# EasyEDA Pro project ADA4530_2025-03-15.epro, board PCB4
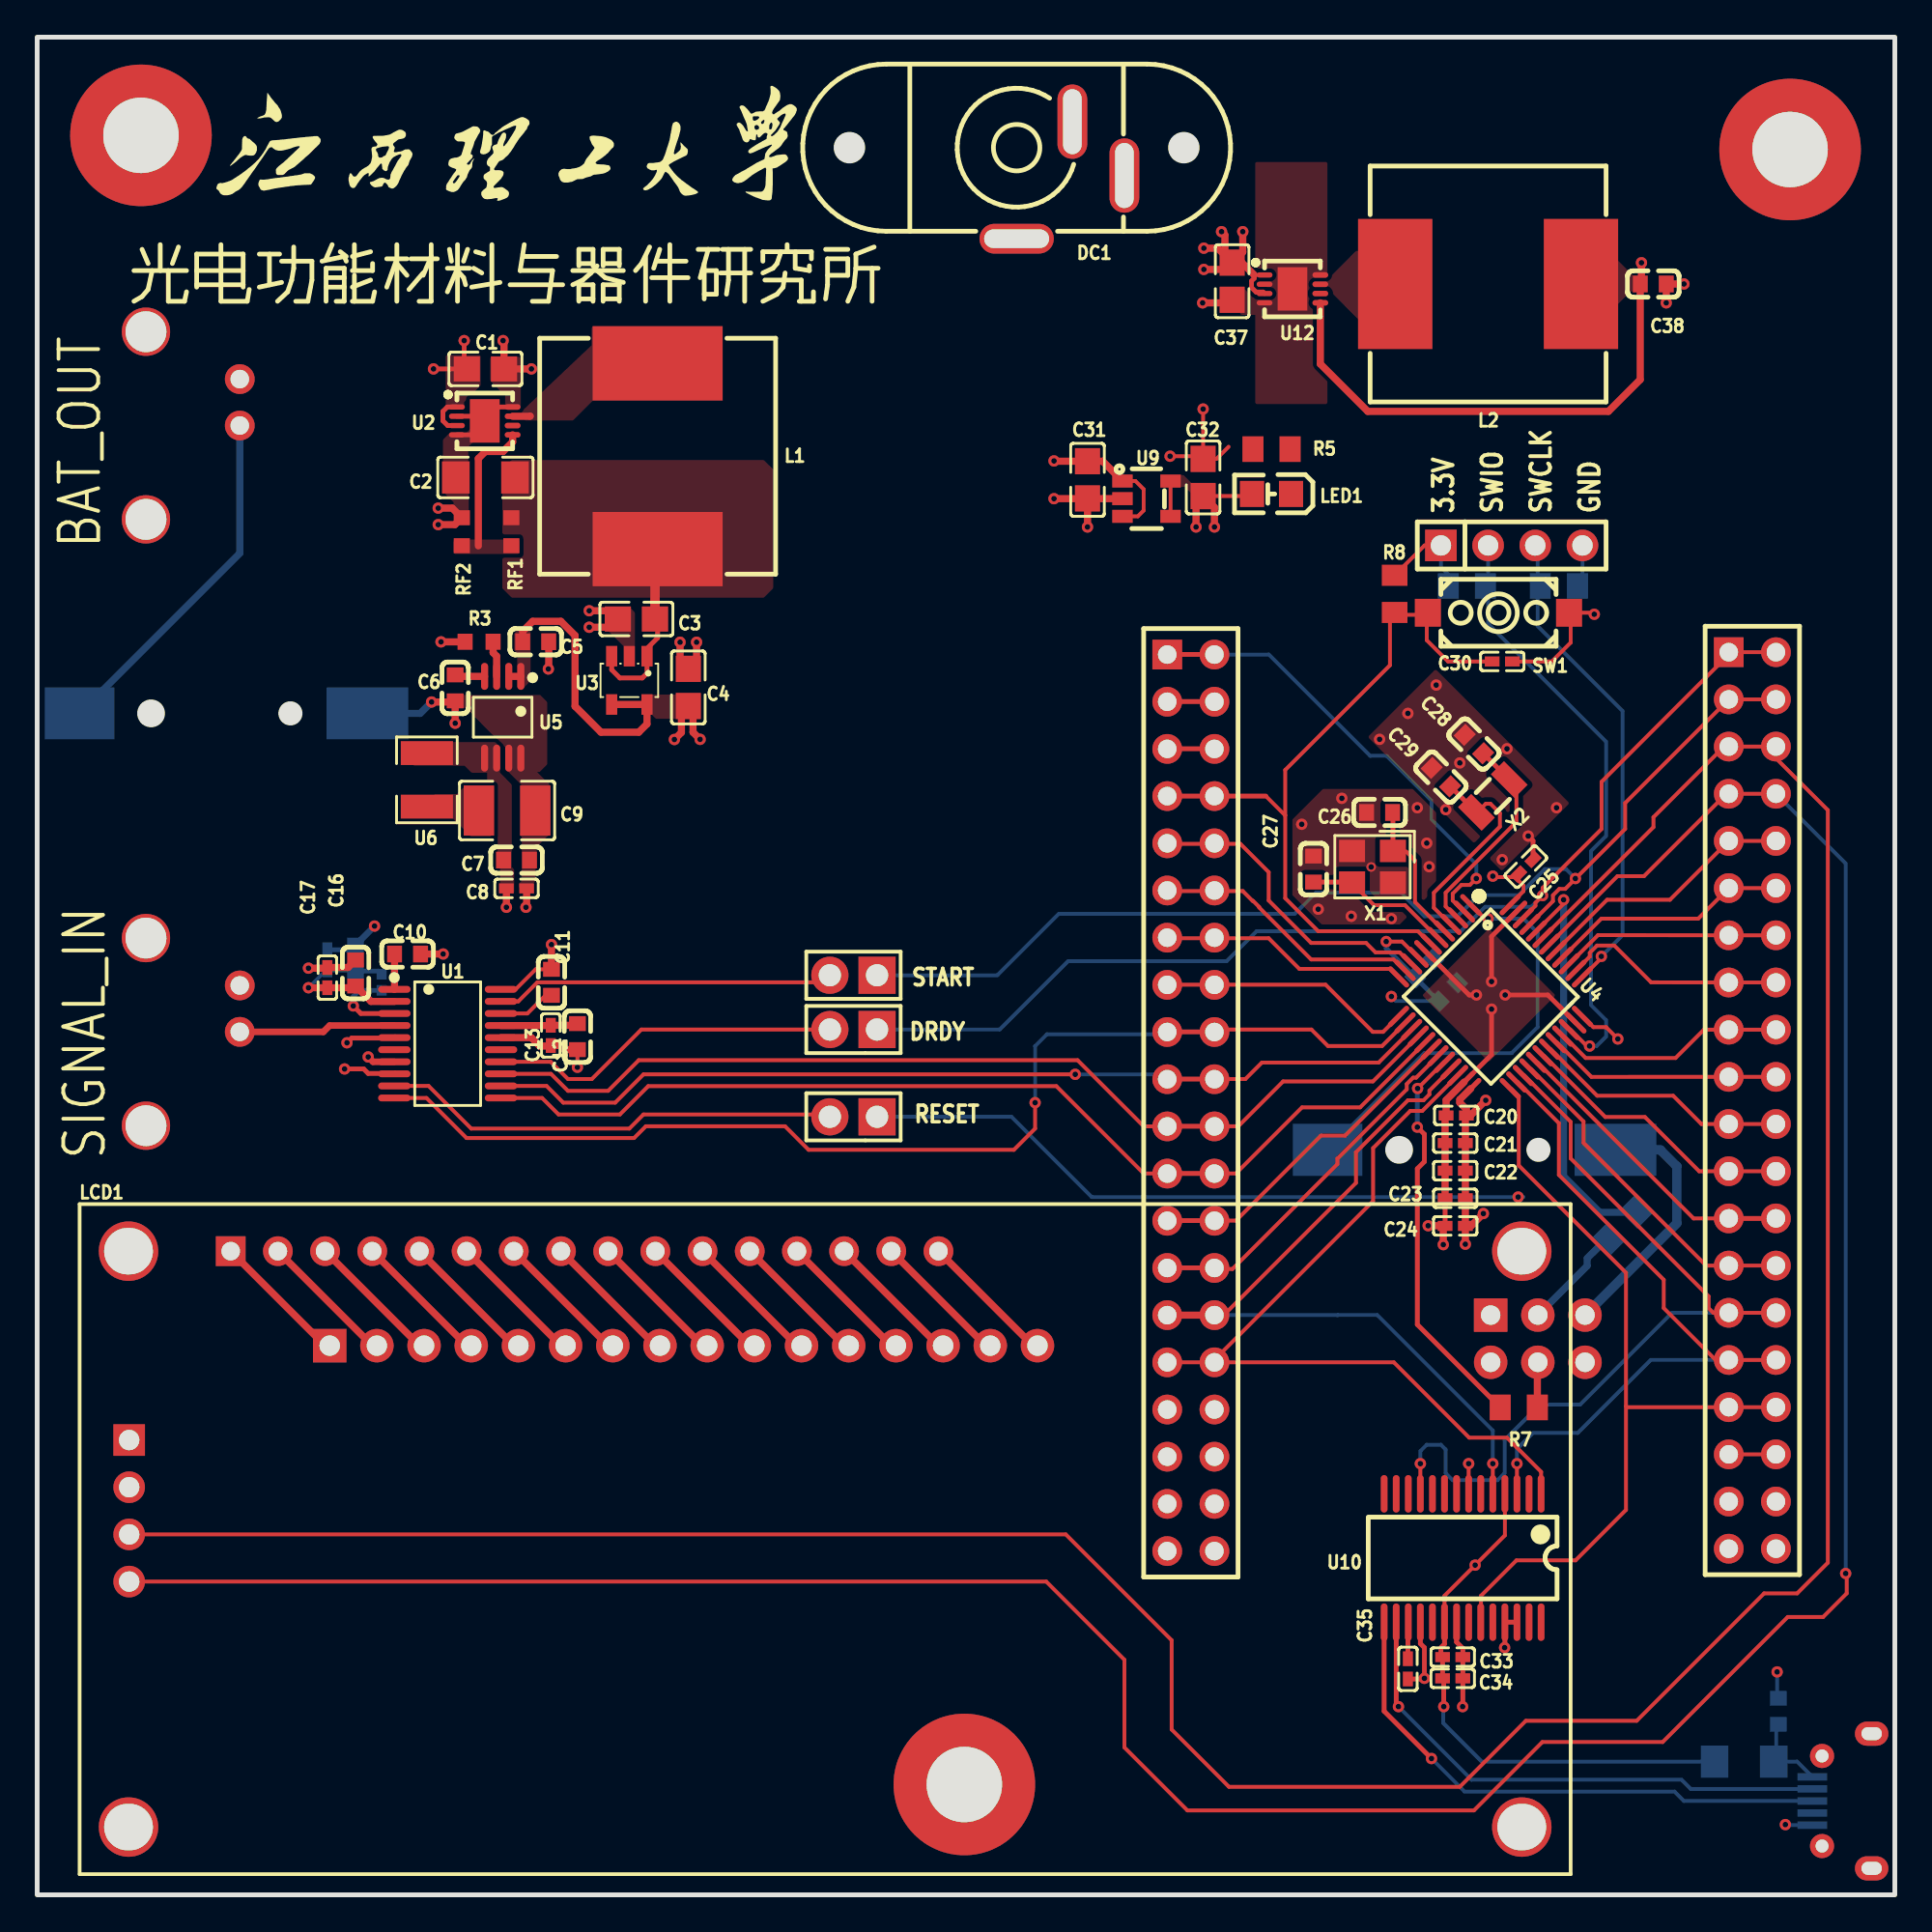
[diagram p10: board, top side]
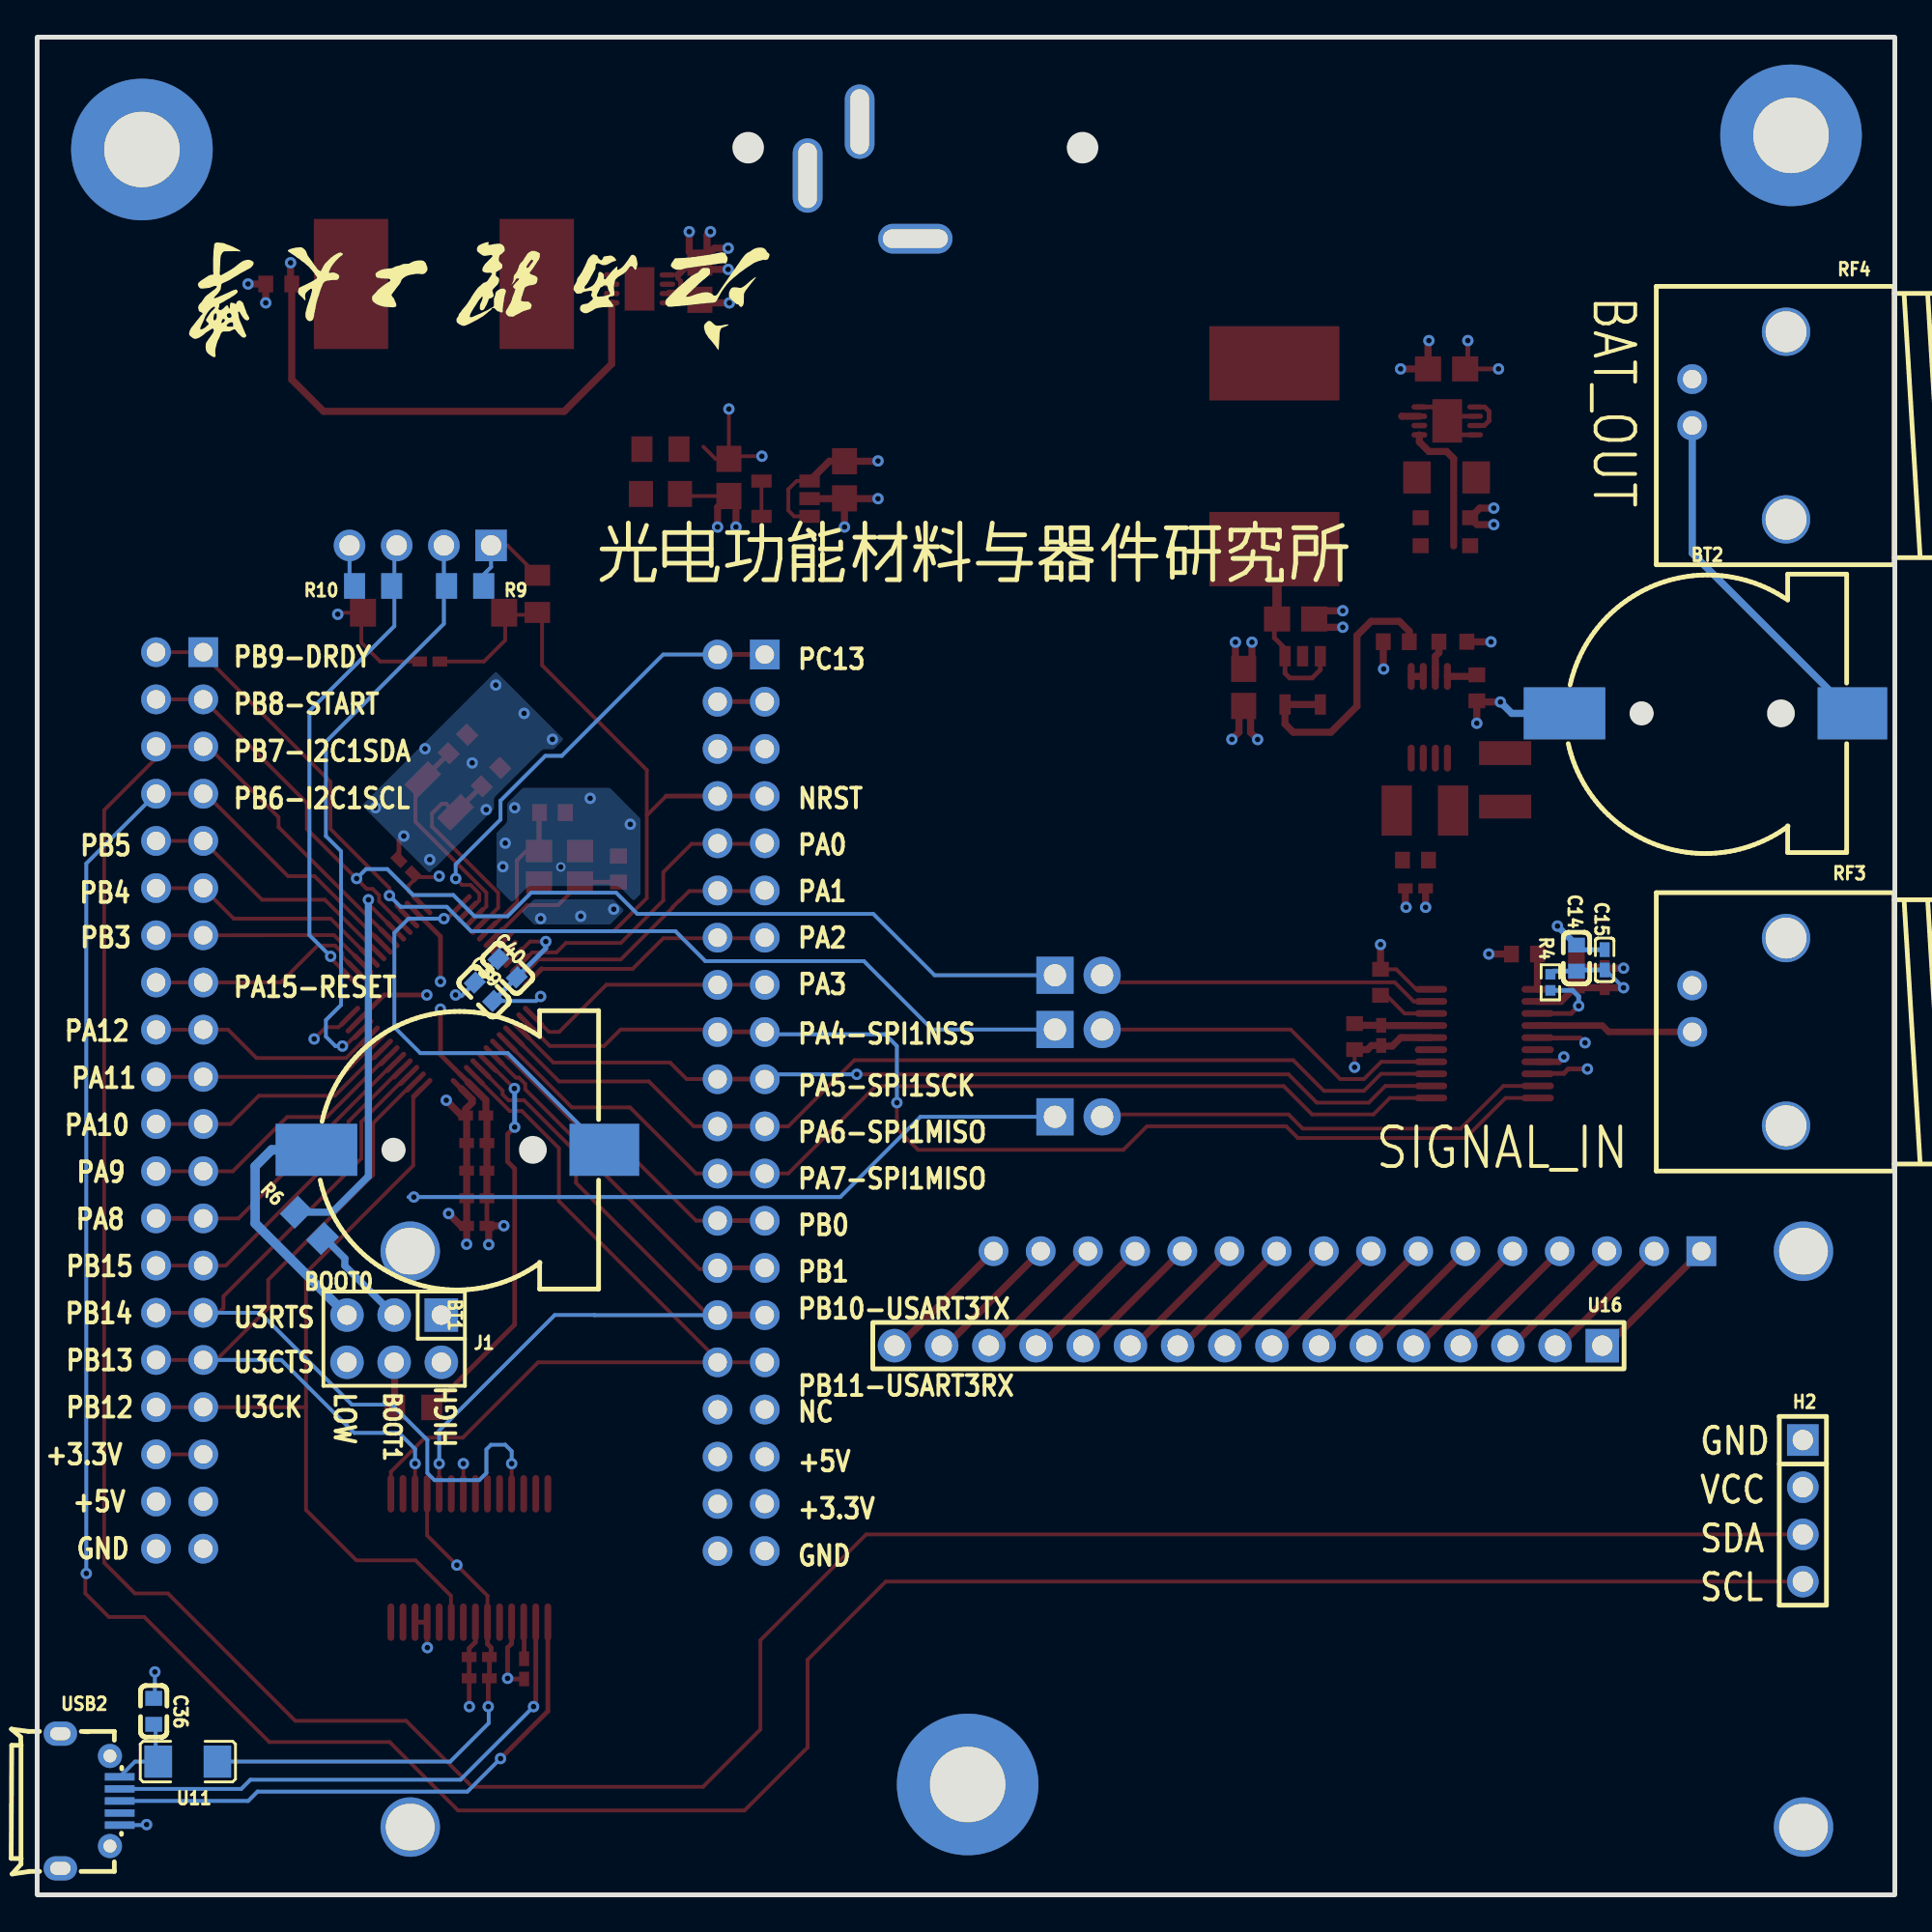
[diagram p11: board, bottom side, seen from below]

Outline 100 x 100 mm; copper layers: Top Layer, 内层1-GND, 内层2-power, Bottom Layer. Coordinates in mm from the lower left corner of the outline.
Outline path: rectangle 0,100 100,0
Stack: Top Layer 0.035mm 外层铜厚1oz / Dielectric1 0.2104mm 7628 RC49% 8.6mil / 内层1-GND 0.0152mm 内层铜厚 / Dielectric2 1.065mm 1.1mm H/HOZ Copper / 内层2-power 0.0152mm 内层铜厚 / Dielectric3 0.2104mm 7628 RC49% 8.6mil / Bottom Layer 0.035mm 外层铜厚1oz

## Design rules (mm)
template: 自定义配置
spacing copperThickness1oz (default): track to track 0.102, other pairs 0.152 to 0.3
spacing copperThickness2oz: track to track 0.203, other pairs 0.152 to 0.3
track width copperThickness1oz (default): min 0.127, default 0.254, max 2.54
track width copperThickness2oz: min 0.203, default 0.254, max 2.54
differential pair differentialPair (default): width min 0.127, default 0.254, max 2.54; gap min 0.152, default 0.152
via viaSize (default): diameter min 0.5, default 0.61, max 10; hole min 0.3, default 0.305, max 6.299
net AGND uses quanlianjie
net +12V uses quanlianjie
net $1N9515 uses quanlianjie
net +5V uses quanlianjie
net REFP uses quanlianjie
net +3.3V2 uses quanlianjie
net +5V2 uses quanlianjie
net $1N9516 uses quanlianjie
net $1N22122 uses quanlianjie
net $1N9520 uses quanlianjie
net $1N25600 uses quanlianjie

## Placement (name value [footprint] x y rotation side)
BT1  BS-12-B3AA003  [BAT-SMD_BS-12-B3AA011]  77.22 40.1 180 bottom
BT2  BS-12-B3AA003  [BAT-SMD_BS-12-B3AA011]  10.03 63.6 180 bottom
C1  2.2uF  [C0805]  24.13 82.14 0 top
C2  10uF  [C1206]  24.13 76.3 0 top
C3  2.2uF  [C0805]  32.26 68.68 0 top
C4  2.2uF  [C0805]  35.05 65 270 top
C5  1uF  [C0603]  26.84 67.45 180 top
C6  1uF  [C0603]  22.5 64.97 90 top
C7  1uF  [C0603]  25.8 55.7 180 top
C8  100nF  [C0402]  25.8 54.18 180 top
C9  22uF  [C1210]  25.3 58.37 0 top
C10  1uF  [C0603]  19.94 50.64 180 top
C11  1uF  [C0603]  27.69 49.12 270 top
C12  1uF  [C0603]  29.08 46.2 90 top
C13  100nF  [C0402]  27.65 46.26 90 top
C14  1uF  [C0603]  17.14 50.42 90 bottom
C15  100nF  [C0402]  15.62 50.33 90 bottom
C16  1uF  [C0603]  17.14 49.62 90 top
C17  100nF  [C0402]  15.62 49.37 90 top
C20  100nF  [C0402]  76.39 41.95 0 top
C21  100nF  [C0402]  76.34 40.47 0 top
C22  100nF  [C0402]  76.34 38.98 0 top
C23  100nF  [C0402]  76.34 37.5 0 top
C24  100nF  [C0402]  76.34 36.01 0 top
C25  4.7uF  [C0402]  80.14 55.34 225 top
C26  10pF  [C0603]  72.26 58.26 0 top
C27  10pF  [C0603]  68.71 55.22 270 top
C28  18pF  [C0603]  77.34 61.95 315 top
C29  18pF  [C0603]  75.56 60.17 315 top
C30  100nF  [C0402]  78.87 66.39 180 top
C31  2.2uF  [C0805]  56.54 76.17 90 top
C32  2.2uF  [C0805]  62.76 76.3 270 top
C33  100nF  [C0402]  76.2 12.8 0 top
C34  4.7uF  [C0402]  76.2 11.66 0 top
C35  100nF  [C0402]  73.79 12.16 270 top
C36  10nF  [C0603]  93.73 9.88 270 bottom
C37  2.2uF  [C0805]  64.33 86.86 270 top
C38  22uF  [C0603]  87 86.71 180 top
C39  1uF  [C0603]  75.95 48.61 225 bottom
C40  10nF  [C0603]  74.68 49.88 225 bottom
DC1  DC-018-2.5A-2.5  [DC-IN-TH_DC-018]  55.63 92.3 90 top
H1  PZ254V-11-04P  [HDR-TH_4P-P2.54-V-M]  79.38 72.64 0 top
H2  PZ254V-11-04P  [HDR-TH_4P-P2.54-V-M]  4.95 20.67 270 bottom
H3  PZ254V-11-02P  [HDR-TH_2P-P2.54-V-M]  43.94 41.88 180 top
H4  PZ254V-11-02P  [HDR-TH_2P-P2.54-V-M]  43.94 49.5 180 top
H5  PZ254V-11-02P  [HDR-TH_2P-P2.54-V-M]  43.94 46.58 180 top
J1  2.54-2*3P针  [HDR-TH_6P-P2.54-V-M-R2-C3-S2.54-1]  80.78 29.94 0 bottom
L1  18uH  [IND-SMD_L12.7-W12.7]  33.4 77.44 270 top
L2  18uH  [IND-SMD_L12.7-W12.7]  78.11 86.71 0 top
LCD1  HS1602A-Y  [LCD1602]  42.42 19.15 0 top
LED1  YLED0805G  [LED0805-FD]  66.45 75.41 0 top
NOREF  -  [Pad_e1566]  5.59 94.71 0 top
NOREF#2  -  [Pad_e1568]  94.36 93.95 0 top
NOREF#3  -  [Pad_e1569]  49.91 5.94 0 top
R3  120kΩ  [R0603]  23.79 67.45 0 top
R4  3Ω  [R0402]  18.54 49.12 90 bottom
R5  1kΩ  [R0805]  66.45 77.82 0 top
R6  10kΩ  [R0805]  85.34 36.04 225 bottom
R7  10kΩ  [R0805]  79.76 26.24 180 top
R8  10kΩ  [R0805]  73.07 70.03 90 top
R9  10kΩ  [R0805]  76.96 70.46 0 bottom
R10  10kΩ  [R0805]  81.91 70.46 180 bottom
RF1  221kΩ  [R0603]  25.53 73.38 90 top
RF2  34kΩ  [R0603]  22.86 73.38 270 top
RF3  KH-BNC50-3511  [ANT-TH_KH-BNC50-3511]  8.38 46.45 90 bottom
RF4  KH-BNC50-3511  [ANT-TH_KH-BNC50-3511]  8.38 79.09 90 bottom
SW1  K2-1107ST-A4DW-06  [KEY-SMD_L6.2-W3.6-LS8.0]  78.66 69.02 0 top
U1  ADS127L11IPWR  [TSSOP-20_L6.5-W4.4-P0.65-LS6.4-BL]  22.1 45.82 270 top
U2  ADP2370ACPZ-R7  [LFCSP-8_L3.0-W3.0-P0.50-BL-EP_ADP2370ACPZ-R7]  24.09 79.34 270 top
U3  ADP7118AUJZ-5.0-R7  [SOT-23-5_L3.0-W1.7-P0.95-LS2.8-BR]  31.88 65.38 90 top
U4  STM32F103C8T6  [LQFP-48_L7.0-W7.0-P0.50-LS9.0-BL]  78.23 48.35 225 top
U5  REF6041IDGKR  [VSSOP-8_L3.0-W3.0-P0.65-LS4.9-BL]  25.06 63.39 180 top
U6  47mΩ  [R1210]  20.98 60.02 90 top
U9  ADP7118AUJZ-3.3-R7  [TSOT-23-5_L2.9-W1.6-P0.95-LS2.8-BR]  59.72 75.16 180 top
U10  FT232RL-REEL  [SSOP-28_L10.2-W5.3-P0.65-LS7.8-BL]  76.73 18.13 180 top
U11  ILB1206ER260V  [L1206]  91.89 7.17 180 bottom
U12  ADP2370ACPZ-R7  [LFCSP-8_L3.0-W3.0-P0.50-BL-EP_ADP2370ACPZ-R7]  67.57 86.45 270 top
U13  2.54-2*20  [HDR-TH_40P-P2.54-V-F-R2-C20-S2.54]  62.1 42.64 270 top
U14  2.54-2*20  [HDR-TH_40P-P2.54-V-F-R2-C20-S2.54]  92.33 42.76 270 top
U16  ZX-PZ2.54-1-16PZZ  [HDR-TH_16P-P2.54-V-M-2]  34.8 29.56 0 bottom
USB2  MicroXNJ  [MICRO-USB-SMD_MICROXNJ]  97.16 5.05 270 bottom
X1  8MHz  [CRYSTAL-SMD_4P-L3.2-W2.5-BL]  71.88 55.34 180 top
X2  32.768kHz  [FC-135R_L3.2-W1.5]  78.36 59.15 225 top

## Footprints (pads in the part's own frame, mm; a bottom-side part is the same pattern mirrored in y, then rotated)
ANT-TH_KH-BNC50-3511
  round 1.6 hole 1: 1(0,2.525) 2(2.5,2.525)
  round 2.601 hole 2.2: 3(5.05,-2.525) 4(-5.05,-2.525)
BAT-SMD_BS-12-B3AA011
  rect 3.75x2.8 smd: 1(7.75,0)
  rect 4.4x2.8 smd: 2(-7.75,0)
C0402
  rect 0.79x0.54 smd: 1(-0.545,0) 2(0.545,0)
C0603
  rect 0.8x0.9 smd: 1(-0.7,0) 2(0.7,0)
C0805
  rect 1.41x1.35 smd: 1(-1,0) 2(1,0)
C1206
  rect 1.485x1.728 smd: 1(-1.593,0) 2(1.593,0)
C1210
  rect 1.635x2.7 smd: 1(-1.518,0) 2(1.518,0)
CRYSTAL-SMD_4P-L3.2-W2.5-BL
  rect 1.4x1.2 smd: 1(-1.1,-0.85) 2(1.1,-0.85) 3(1.1,0.85) 4(-1.1,0.85)
DC-IN-TH_DC-018
  oval 1.6x4 hole 1x3.5: 1(-3.15,2.9)
  oval 4x1.6 hole 3.5x1: 2(0.25,-2.9) 3(3.15,-0.1)
FC-135R_L3.2-W1.5
  rect 1x1.8 smd: 1(-1.25,0) 2(1.25,0)
HDR-TH_2P-P2.54-V-M
  rect 2x2 hole 1.2: 1(-1.27,0)
  round 2 hole 1.2: 2(1.27,0)
HDR-TH_4P-P2.54-V-M
  rect 1.7x1.7 hole 1.1: 1(-3.81,0)
  round 1.7 hole 1.1: 2(-1.27,0) 3(1.27,0) 4(3.81,0)
HDR-TH_6P-P2.54-V-M-R2-C3-S2.54-1
  rect 1.8x1.8 hole 1.05: 1(-2.54,-1.27)
  round 1.8 hole 1.05: 2(-2.54,1.27) 3(0,-1.27) 4(0,1.27) 5(2.54,-1.27) 6(2.54,1.27)
HDR-TH_16P-P2.54-V-M-2
  rect 1.8x1.8 hole 1.1: 1(-19.05,0)
  round 1.8 hole 1.1: 2(-16.51,0) 3(-13.97,0) 4(-11.43,0) 5(-8.89,0) 6(-6.35,0) 7(-3.81,0) 8(-1.27,0) 9(1.27,0) 10(3.81,0) 11(6.35,0) 12(8.89,0) 13(11.43,0) 14(13.97,0) 15(16.51,0) 16(19.05,0)
HDR-TH_40P-P2.54-V-F-R2-C20-S2.54
  rect 1.6x1.6 hole 1: 1(-24.13,-1.27)
  round 1.6 hole 1: 2(-24.13,1.27) 3(-21.59,-1.27) 4(-21.59,1.27) 5(-19.05,-1.27) 6(-19.05,1.27) 7(-16.51,-1.27) 8(-16.51,1.27) 9(-13.97,-1.27) 10(-13.97,1.27) 11(-11.43,-1.27) 12(-11.43,1.27) 13(-8.89,-1.27) 14(-8.89,1.27) 15(-6.35,-1.27) 16(-6.35,1.27) 17(-3.81,-1.27) 18(-3.81,1.27) 19(-1.27,-1.27) 20(-1.27,1.27) 21(1.27,-1.27) 22(1.27,1.27) 23(3.81,-1.27) 24(3.81,1.27) 25(6.35,-1.27) 26(6.35,1.27) 27(8.89,-1.27) 28(8.89,1.27) 29(11.43,-1.27) 30(11.43,1.27) 31(13.97,-1.27) 32(13.97,1.27) 33(16.51,-1.27) 34(16.51,1.27) 35(19.05,-1.27) 36(19.05,1.27) 37(21.59,-1.27) 38(21.59,1.27) 39(24.13,-1.27) 40(24.13,1.27)
IND-SMD_L12.7-W12.7
  rect 4x7 smd: 1(-5,0) 2(5,0)
KEY-SMD_L6.2-W3.6-LS8.0
  rect 1.4x1.5 smd: 1(-3.8,0) 2(3.8,0)
L1206
  rect 1.485x1.728 smd: 1(-1.593,0) 2(1.593,0)
LCD1602
  round 3.2 hole 2.625x2.5: 0(-37.5,15.5) 0(-37.5,-15.5) 0(37.5,15.5) 0(37.5,-15.5)
  rect 1.6x1.6 hole 1: 1(-32,15.5)
  round 1.6 hole 1: 2(-29.46,15.5) 3(-26.92,15.5) 4(-24.38,15.5) 5(-21.84,15.5) 6(-19.3,15.5) 7(-16.76,15.5) 8(-14.22,15.5) 9(-11.68,15.5) 10(-9.14,15.5) 11(-6.6,15.5) 12(-4.06,15.5) 13(-1.52,15.5) 14(1.02,15.5) 15(3.56,15.5) 16(6.1,15.5)
LED0805-FD
  rect 1.3x1.399 smd: 1(-1.05,0) 2(1.05,0)
LFCSP-8_L3.0-W3.0-P0.50-BL-EP_ADP2370ACPZ-R7
  rect 2.34x1.6 smd: 0(0,0)
  oval 0.28x0.85 smd: 1(-0.75,-1.5) 2(-0.25,-1.5) 3(0.25,-1.5) 4(0.75,-1.5)
  oval 0.3x0.85 smd: 5(0.75,1.5) 6(0.25,1.5) 7(-0.25,1.5) 8(-0.75,1.5)
LQFP-48_L7.0-W7.0-P0.50-LS9.0-BL
  oval 0.27x1.5 smd: 1(-2.75,-4.25) 2(-2.25,-4.25) 3(-1.75,-4.25) 4(-1.25,-4.25) 5(-0.75,-4.25) 6(-0.25,-4.25) 7(0.25,-4.25) 8(0.75,-4.25) 9(1.25,-4.25) 10(1.75,-4.25) 11(2.25,-4.25) 12(2.75,-4.25) 25(2.75,4.25) 26(2.25,4.25) 27(1.75,4.25) 28(1.25,4.25) 29(0.75,4.25) 30(0.25,4.25) 31(-0.25,4.25) 32(-0.75,4.25) 33(-1.25,4.25) 34(-1.75,4.25) 35(-2.25,4.25) 36(-2.75,4.25)
  oval 1.5x0.27 smd: 13(4.25,-2.75) 14(4.25,-2.25) 15(4.25,-1.75) 16(4.25,-1.25) 17(4.25,-0.75) 18(4.25,-0.25) 19(4.25,0.25) 20(4.25,0.75) 21(4.25,1.25) 22(4.25,1.75) 23(4.25,2.25) 24(4.25,2.75) 37(-4.25,2.75) 38(-4.25,2.25) 39(-4.25,1.75) 40(-4.25,1.25) 41(-4.25,0.75) 42(-4.25,0.25) 43(-4.25,-0.25) 44(-4.25,-0.75) 45(-4.25,-1.25) 46(-4.25,-1.75) 47(-4.25,-2.25) 48(-4.25,-2.75)
MICRO-USB-SMD_MICROXNJ
  rect 0.4x1.6 smd: 1(-1.3,1.597) 2(-0.65,1.597) 3(0,1.597) 4(0.65,1.597) 5(1.3,1.597)
  round 1.3 hole 0.7: 6(2.425,1.074) 9(-2.425,1.073)
  oval 1.3x1.8 hole 0.7x1.1: 7(3.625,-1.597) 8(-3.625,-1.597)
Pad_e1566
  round 7.62 hole 4.064: 1(0,0)
Pad_e1568
  round 7.62 hole 4.064: 1(0,0)
Pad_e1569
  round 7.62 hole 4.064: 1(0,0)
R0402
  rect 0.566x0.54 smd: 1(-0.433,0) 2(0.433,0)
R0603
  rect 0.806x0.864 smd: 1(-0.753,0) 2(0.753,0)
R0805
  rect 1.133x1.377 smd: 1(-1,0) 2(1,0)
R1210
  rect 1.282x2.808 smd: 1(-1.441,0) 2(1.441,0)
SOT-23-5_L3.0-W1.7-P0.95-LS2.8-BR
  rect 1.1x0.6 smd: 1(1.3,-0.95) 2(1.3,0) 3(1.3,0.95) 4(-1.3,0.95) 5(-1.3,-0.95)
SSOP-28_L10.2-W5.3-P0.65-LS7.8-BL
  oval 0.364x2.015 smd: 1(-4.225,-3.455) 2(-3.575,-3.455) 3(-2.925,-3.455) 4(-2.275,-3.455) 5(-1.625,-3.455) 6(-0.975,-3.455) 7(-0.325,-3.455) 8(0.325,-3.455) 9(0.975,-3.455) 10(1.625,-3.455) 11(2.275,-3.455) 12(2.925,-3.455) 13(3.575,-3.455) 14(4.225,-3.455) 15(4.225,3.455) 16(3.575,3.455) 17(2.925,3.455) 18(2.275,3.455) 19(1.625,3.455) 20(0.975,3.455) 21(0.325,3.455) 22(-0.325,3.455) 23(-0.975,3.455) 24(-1.625,3.455) 25(-2.275,3.455) 26(-2.925,3.455) 27(-3.575,3.455) 28(-4.225,3.455)
TSOT-23-5_L2.9-W1.6-P0.95-LS2.8-BR
  rect 1.1x0.7 smd: 1(1.294,-0.951) 2(1.294,-0.001) 3(1.294,0.951) 4(-1.294,0.951) 5(-1.294,-0.949)
TSSOP-20_L6.5-W4.4-P0.65-LS6.4-BL
  oval 0.364x1.742 smd: 1(-2.925,-2.871) 2(-2.275,-2.871) 3(-1.625,-2.871) 4(-0.975,-2.871) 5(-0.325,-2.871) 6(0.325,-2.871) 7(0.975,-2.871) 8(1.625,-2.871) 9(2.275,-2.871) 10(2.925,-2.871) 11(2.925,2.871) 12(2.275,2.871) 13(1.625,2.871) 14(0.975,2.871) 15(0.325,2.871) 16(-0.325,2.871) 17(-0.975,2.871) 18(-1.625,2.871) 19(-2.275,2.871) 20(-2.925,2.871)
VSSOP-8_L3.0-W3.0-P0.65-LS4.9-BL
  oval 0.38x1.45 smd: 1(-0.975,-2.2) 2(-0.325,-2.2) 3(0.325,-2.2) 4(0.975,-2.2) 5(0.975,2.2) 6(0.325,2.2) 7(-0.325,2.2) 8(-0.975,2.2)

## Nets
As in the schematic, except:
AGND: BT1.2 BT2.2 C1.2 C2.1 C3.1 C4.1 C5.1 C6.1 C7.1 C8.1 C9.2 C10.1 C11.1 C14.2 C15.2 C16.2 C17.2 C20.1 C21.1 C22.1 C23.1 C24.1 C25.1 C26.1 C27.1 C28.1 C29.1 C30.1 C31.1 C32.1 C33.2 C34.2 C35.2 C36.1 C37.2 C38.1 C39.1 C40.1 DC1.2 DC1.3 H1.4 H2.1 J1.5 J1.6 NOREF.1 NOREF#2.1 NOREF#3.1 R3.1 R5.1 R10.1 RF2.1 RF3.2 RF3.3 RF3.4 RF4.2 RF4.3 RF4.4 SW1.2 U1.5 U1.8 U1.20 U2.0 U2.2 U2.4 U2.8 U3.2 U4.8 U4.23 U4.35 U4.47 U5.7 U5.8 U9.2 U10.7 U10.18 U10.21 U10.25 U10.26 U12.0 U12.2 U12.4 U12.8 U13.39 U13.40 U14.39 U14.40 USB2.5 X1.2 X1.4

Pads without a net: LCD1 0; U1 6; U2 6; U10 2 6 8 9 10 12 13 14 19 22 24 27 28; U12 6; U13 33 34; USB2 4 6 7 8 9

## Via types
v1: diameter 0.61, hole 0.305, Top Layer to Bottom Layer, 100 vias
v2: diameter 0.508, hole 0.305, Top Layer to Bottom Layer, 1 via

## Routing (per net, layer and track width the routed paths; a pad name or vN(x,y) marks a point on that pad's centre or on a via; arc(x,y) is an arc through that point)
+3.3V2: length 219
  Top Layer w0.203: R8.2 74.68,72.64 H1.1 ; LED1.1 65.29,75.3 C32.2 ; U9.4 U9.5 ; 74.34,50.44 73.47,51.32 v1(72.62,51.32) ; v1(78.36,54.84) 78.41,54.79 79.58,54.79 C25.2 79.75,54.59 80.01,54.33 80.01,54.03 79.29,53.31 ; v1(85.09,46.07) 84.46,46.71 83.77,46.71 83.18,47.3 ; v1(29.08,44.55) C12.1 ; U14.35 U14.36
  Top Layer w0.381: v1(77.98,42.77) 77.16,41.95 C20.2 ; C20.2 76.93,42.29 76.58,42.64 76.58,42.81 U4.24 ; C20.2 76.88,41.9 C21.2 C22.2 C23.2 C24.2 ; C12.1 28.39,45.5 28.17,45.72 C13.1 27.62,45.69 27.05,45.69 26.6,46.14 U1.16 ; C24.2 77.19,36.01 v1(77.85,36.67) ; C24.2 v1(76.88,35.02) ; v1(62.38,73.63) 62.38,74.92 C32.2 63.37,74.69 v1(63.37,73.63)
  内层2-power w0.381: v1(85.09,46.07) 85.09,45.56 82.3,42.77 v1(77.98,42.77) ; U14.35 83.2,23.71 J1.2 70.62,21.05 U13.38 U13.37 ; 77.98,31.47 77.98,33.84 77.97,33.84 77.97,35.66 78.99,36.67 78.99,41.63 77.98,42.64 v1(77.98,42.77) ; v1(78.36,54.84) 78.36,53.82 v1(72.9,48.36) 72.9,47.85 v1(77.98,42.77)
  内层2-power w0.508: 4.95,21.94 51.44,21.94 57.53,28.04 57.53,36.17 49.15,44.55 v1(29.08,44.55) ; 77.98,31.47 J1.1
  内层2-power w0.762: J1.1 J1.2
  Bottom Layer w0.203: H1.1 75.56,71.47 75.96,71.08 R9.1 ; C39.2 73.14,48.12 v1(72.9,48.36)
  Bottom Layer w0.254: v1(72.62,51.32) 72.62,50.95 75.32,48.24 75.45,48.24
+5V: length 29.6
  Top Layer w0.381: C5.2 26.14,68.02 26.67,68.55 28.19,68.55 28.96,67.79 28.96,63.98 30.35,62.58 32.39,62.58 32.83,63.02 U3.5 30.93,64.08 ; U5.1 25.39,65.59 ; v1(34.3,62.19) 34.68,62.57 34.68,63.63 C4.2 35.31,63.74 35.31,62.58 v1(35.69,62.2) ; v1(14.61,48.83) C17.1 17.05,48.83 C16.1 17.97,48.09 U1.2
  Bottom Layer w0.203: C15.1 15.56,49.79 v1(14.61,48.83)
  Bottom Layer w0.254: C15.1 17.08,49.79 C14.1 18.37,49.72 R4.2
+5V2: length 65.8
  Top Layer w0.203: U9.3 59.25,74.2 59.56,74.52 59.56,75.66 59.12,76.11 U9.1 ; U10.20 75.76,16.1 v1(77.41,17.75) 79.01,19.35 U10.4
  Top Layer w0.254: v1(75.72,10.13) 75.72,11.59 C34.1 C33.1 75.56,12.89 75.56,13.31 75.76,13.5 U10.20
  Top Layer w0.381: v1(86.36,87.86) 86.36,86.78 C38.2 86.3,81.57 84.58,79.85 71.63,79.85 69.07,82.41 U12.5 ; v1(54.74,77.19) 54.75,77.17 C31.2 57.36,77.17 U9.1
  Bottom Layer w0.203: U11.2 77.76,7.17 75.69,9.24 75.69,10.11 v1(75.72,10.13)
+12V: length 14.9
  Top Layer w0.254: 22.59,80.09 22.08,80.09 21.84,79.85 21.84,79.35 22.1,79.09 22.59,79.09 ; U12.3 65.99,86.28 65.61,86.28 65.37,86.53 65.37,86.87 65.51,87.02 65.51,87.2 ; v1(21.34,82.14) C1.1 22.99,82.28 v1(22.99,83.66)
  Top Layer w0.381: C37.1 64.85,87.86 65.51,87.2 ; C37.1 63.96,87.5 v1(62.8,87.5) ; C37.1 64.9,88.43 v1(64.9,89.53) ; v1(63.76,89.53) 63.94,89.35 63.94,88.25 63.55,88.64 v1(62.8,88.64)
AGND: length 143.6
  Top Layer w0.203: C30.1 81.53,66.39 82.55,67.41 82.55,68.93 SW1.2 83.74,69.02 v1(83.82,68.93) ; v1(60.99,77.44) 62.62,77.44 C32.1 ; C11.1 26.84,49.82 25.76,48.74 U1.20 ; C32.1 63.48,77.3 64.14,77.95 ; C32.1 v1(62.76,79.98) ; U10.7 v1(77.06,23.21)
  Top Layer w0.254: 22.59,78.59 23.34,78.59 U2.0 ; v1(79.02,48.44) 81.32,48.44 U4.35 ; v1(76.73,10.13) 76.75,10.14 C34.2 C33.2 76.75,13.27 76.41,13.61 U10.21 ; U2.0 23.84,79.59 22.59,79.59 ; U2.0 24.84,80.09 25.59,80.09 ; 19.27,46.19 19.2,46.12 16.93,46.12 v1(16.68,45.87) ; v1(78.29,47.68) 78.29,45.23 U4.23 ; U4.47 78.29,51.59 v1(78.29,49.16) ; U10.26 U10.25 79.01,13.32 v1(78.99,13.31) ; C25.1 80.52,56.74 v1(80.26,56.99) ; C24.1 C23.1 ; 19.27,44.24 19.24,44.22 17.82,44.22 17.58,44.46 v1(16.55,44.46) ; U10.18 74.46,13.52 74.68,13.31 v1(74.68,11.66) 74.64,11.62 C35.2 ; v1(77.48,48.44) 77.08,48.44 U4.8
  Top Layer w0.381: v1(88.65,86.71) C38.1 v1(87.69,85.7) ; v1(54.74,75.16) 56.53,75.16 C31.1 ; v1(22.5,63.07) C6.1 22.44,64.21 v1(21.23,64.21) ; v1(75.69,35) 75.69,35.91 C24.1 75.78,36.02 v1(74.88,36.02) ; C11.1 v1(27.69,51.15) ; v1(21.74,67.45) 23.03,67.45 R3.1 ; v1(62.74,85.7) 64.16,85.7 C37.2 ; C8.1 26.35,53.2 v1(26.31,53.16) ; v1(27.52,65.99) 27.54,66.01 C5.1 ; v1(29.72,69.12) 30.81,69.12 C3.1 30.81,68.23 v1(29.72,68.23) ; v1(14.61,49.88) 15.58,49.88 C17.2 16.74,49.92 C16.2 ; U9.2 56.56,75.16 C31.1 ; v1(21.59,73.76) 22.49,73.76 RF2.1 22.34,74.65 v1(21.59,74.65) ; C31.1 v1(56.54,73.63) ; v1(34.61,67.43) 34.61,66.44 C4.1 35.5,66.44 v1(35.5,67.43) ; C23.1 C22.1 C21.1 75.79,41.9 C20.1 75.84,42.78 U4.23 ; v1(26.61,82.14) C1.2 25.13,83.62 v1(25.08,83.66) ; C10.1 v1(21.86,50.64)
  内层2-power w0.349: v1(16.55,44.46) 16.71,44.29 17.91,44.29 26.31,52.7 v1(26.31,53.16)
  Bottom Layer w0.203: 77.4,48.38 77.17,48.38 C39.1 75.17,50.38 ; 95.81,3.75 94.14,3.75 v1(94.11,3.78) ; v1(93.66,12) 93.66,10.51 93.62,10.47 ; H1.4 83.19,70.73 R10.1
  Bottom Layer w0.254: C15.2 16.89,50.88 C14.2
  Bottom Layer w0.349: 18.16,52.17 v1(18.16,52.15) C14.2
  Bottom Layer w0.381: v1(21.23,64.21) 20.62,63.6 BT2.2
  Bottom Layer w0.508: BT1.2 87.38,40.1 88.27,39.21 88.27,36.15 J1.5
  vias: v1(68.07,57.63) v1(68.96,53.06) v1(70.23,59.03) v1(70.74,52.68) v1(72.26,62.2) v1(72.9,52.55) v1(73.79,63.6) v1(74.3,58.52) v1(74.8,56.61) v1(74.93,55.34) v1(75.31,65.12) v1(75.83,58.42) v1(76.58,60.93) v1(78.87,55.72) v1(79.12,61.69) v1(81.79,58.52) v2(71.81,55.33)
AVDD1: length 4.5
  Top Layer w0.254: U1.3 17.43,47.44 v1(17.02,47.85)
  Bottom Layer w0.254: R4.1 17.35,48.69 17.02,48.36 v1(17.02,47.85)
DGND: length 4.2
  Top Layer w0.381: U1.17 27.64,46.79 C13.2 28.99,46.81 C12.2
VBAT: length 23.4
  Top Layer w0.203: v1(78.11,52.55) 77.98,52.68 77.8,52.68 77.17,53.31
  Bottom Layer w0.203: v1(78.11,52.55) 80.01,52.55 80.77,51.79 80.77,46.71 79.38,45.31 74.67,45.31 BT1.1
AINP: length 8.5
  Top Layer w0.349: 15.75,46.79 U1.4
  Top Layer w0.35: 15.75,46.79 15.41,46.45 RF3.1
BOOT0: length 21.8
  Top Layer w0.203: 80.72,51.89 82.17,53.35 v1(82.17,53.57)
  Bottom Layer w0.381: v1(82.17,53.57) 82.17,38.68 84.11,36.75 R6.1
BOOT1: length 21.4
  Top Layer w0.203: 75.77,44.82 75.73,44.82 v1(74.31,43.41)
  Top Layer w0.254: R7.2 74.3,30.7 74.3,39.09 74.68,39.47 74.68,40.94 v1(74.3,41.32)
  Bottom Layer w0.254: v1(74.31,43.41) 74.3,43.39 v1(74.3,41.32)
CAPA: length 1.9
  Top Layer w0.381: C10.2 19.24,48.76 U1.1
CAPD: length 3.1
  Top Layer w0.203: U1.18 26.39,47.44 27.37,48.42 C11.2
CS#: length 62.3
  Top Layer w0.203: 73.65,46.94 72.4,45.69 69.48,45.69 68.59,46.58 63.52,46.58 63.39,46.45 ; v1(53.72,42.64) 53.72,41.25 52.58,40.1 41.53,40.1 40.26,41.37 32.77,41.37 32.13,40.74 23.11,40.74 20.96,42.89 U1.10
  Top Layer w0.254: 63.39,46.45 60.85,46.45
  Bottom Layer w0.203: U13.17 60.71,46.33 54.36,46.33 53.72,45.69 v1(53.72,42.64)
DRDY: length 19.2
  Top Layer w0.203: H5.2 32.52,46.58 29.86,43.91 28.58,43.91 27.65,44.84 U1.14
NRST: length 40.6
  Top Layer w0.203: 74.61,68.89 74.59,68.9 72.82,68.9 72.82,66.19 67.18,60.55 67.18,58.1 ; C30.2 75.95,66.39 74.8,67.54 74.8,68.96 SW1.1 ; 75.05,51.15 74.32,51.88 68.96,51.88 67.18,53.65 67.18,58.1 ; 67.18,58.1 66.14,59.15
  Top Layer w0.254: 66.14,59.15 U13.8 U13.7
OSC32-IN: length 11.5
  Top Layer w0.203: 79.24,60 79.63,59.61 79.63,57.76 75.82,53.95 75.82,53.21 76.46,52.56
  Top Layer w0.254: 79.24,60.04 77.97,61.32 77.97,61.58
OSC32-OUT: length 11.5
  Top Layer w0.203: 76.11,52.21 75.18,53.13 75.18,53.95 78.74,57.5 78.74,58.23 78.23,58.73 77.98,58.73 77.47,58.23
  Top Layer w0.254: X2.2 76.19,59.56 76.19,59.67
OSC-IN: length 7.9
  Top Layer w0.203: 72.98,56.15 73.7,56.15 74.17,55.69 74.17,53.44 75.76,51.85
  Top Layer w0.254: C26.2 72.98,58.25 X1.1
OSC-OUT: length 7.9
  Top Layer w0.203: 70.78,54.45 71.96,53.27 73.63,53.27 75.4,51.5
  Top Layer w0.254: X1.3 70.76,54.52 C27.2
PA0: length 16.7
  Top Layer w0.203: 73.99,50.09 73.34,50.73 72.05,50.73 71.54,51.24 68.58,51.24 66.29,53.53 66.29,55.05 64.77,56.57 60.83,56.57
PA1: length 14.6
  Top Layer w0.203: 60.83,54.03 64.9,54.03 65.43,53.5 65.46,53.5 65.78,53.18 65.78,53.15 68.58,50.35 73.02,50.35 73.64,49.73
PA2: length 13.3
  Top Layer w0.203: 73.28,49.38 72.82,49.84 67.94,49.84 66.29,51.49 60.83,51.49
PA3: length 13.9
  Top Layer w0.203: 73.3,47.3 72.45,46.45 71.9,46.45 69.36,48.99 60.85,48.99
PA5: length 51.2
  Top Layer w0.203: 63.39,43.91 65.04,43.91 65.93,44.8 72.22,44.8 74,46.59 ; U1.12 27.42,43.54 28.32,42.64 31.12,42.64 32.64,44.17 v1(55.88,44.17)
  Top Layer w0.254: 63.39,43.91 60.85,43.91
  Bottom Layer w0.203: v1(55.88,44.17) 60.57,44.17 U13.19
PA6: length 53.9
  Top Layer w0.203: U13.21 59.57,41.37 56.01,44.93 32.39,44.93 30.73,43.28 28.58,43.28 27.66,44.19 U1.13 ; 74.36,46.24 71.91,43.79 67.07,43.79 64.66,41.37 63.39,41.37
  Top Layer w0.254: 63.39,41.37 60.85,41.37
PA7: length 55.6
  Top Layer w0.203: 74.71,45.88 71.22,42.39 68.09,42.39 64.53,38.83 63.39,38.83 ; U13.23 60.82,38.83 59.56,38.83 54.86,43.53 32.89,43.53 31.37,42.01 28.07,42.01 27.18,42.89 U1.11
  Top Layer w0.254: 63.39,38.83 60.85,38.83
PA8: length 16.4
  Top Layer w0.203: 80.76,44.81 89.17,36.41 91.12,36.41
  Top Layer w0.254: 93.66,36.41 91.12,36.41
PA9: length 15.1
  Top Layer w0.203: 81.12,45.17 84.41,41.87 86.54,41.87 89.47,38.95 U14.23 U14.24
PA10: length 13.8
  Top Layer w0.203: 89.59,41.49 U14.21 U14.22 ; 89.59,41.49 88.07,43.01 83.98,43.01 81.47,45.52
PA11: length 12.5
  Top Layer w0.203: 81.82,45.87 83.67,44.03 U14.19 U14.20
PA12: length 12.5
  Top Layer w0.203: 89.72,46.57 88.19,45.05 83.36,45.05 82.18,46.23 ; U14.18 U14.17 89.72,46.57
PA15: length 65.1
  Top Layer w0.203: 82.84,49.77 82.84,49.77 83.58,50.51 83.58,50.71 83.97,51.1 84.9,51.1 86.88,49.12 U14.15 U14.16
  内层2-power w0.203: v1(79.72,37.56) 91.06,48.9 U14.15
  Bottom Layer w0.203: 80.01,37.56 56.77,37.56 52.45,41.88 H3.1
PB0: length 18
  Top Layer w0.203: 63.39,36.29 64.53,36.29 69.1,40.87 70.4,40.87 75.06,45.53
  Top Layer w0.254: 60.85,36.29 63.39,36.29
PB1: length 19.7
  Top Layer w0.203: 75.42,45.18 74.23,43.99 74.07,43.99 73.73,43.65 73.73,43.36 69.99,39.63 69.99,39.34 64.34,33.69 63.45,33.69 63.39,33.75
  Top Layer w0.254: 63.39,33.75 60.85,33.75
PB3: length 11.7
  Top Layer w0.203: 82.49,50.13 84.02,51.66 U14.13 U14.14
PB4: length 13
  Top Layer w0.203: 82.13,50.48 84.2,52.55 89.42,52.55 U14.11 U14.12
PB5: length 14.3
  Top Layer w0.203: 81.78,50.83 84.51,53.57 87.89,53.57 U14.9 U14.10
PB6: length 165.2
  Top Layer w0.203: 91.06,59.27 90.94,59.28 86.5,54.84 85.07,54.84 81.42,51.19 81.42,51.19 ; H2.4 54.32,16.86 58.53,12.65 58.53,7.93 61.92,4.54 77.34,4.54 81.03,8.23 87.5,8.23 94.23,14.96 96.14,14.96 97.41,16.23 97.41,17.24 ; U14.7 U14.8
  Bottom Layer w0.203: U14.8 97.35,55.52 v1(97.35,17.3)
PB7: length 167.1
  Top Layer w0.203: 81.07,51.54 87.01,57.48 87.01,58.01 90.82,61.82 U14.5 U14.6 93.6,61.19 96.39,58.39 96.39,17.88 94.74,16.23 92.96,16.23 86.11,9.37 80.14,9.37 76.58,5.81 64.16,5.81 61.07,8.9 61.07,13.71 55.37,19.4 H2.3
PB8: length 60.5
  Top Layer w0.203: 80.36,52.25 80.36,52.26 81.6,53.49 81.6,53.81 81.94,54.15 82.26,54.15 85.48,57.38 85.48,58.77 U14.3 U14.4
  Bottom Layer w0.203: H4.1 51.69,49.5 54.99,52.8 67.69,52.8 68.83,53.95 73.41,53.95 74.68,52.68 76.45,52.68 77.6,53.82 79.76,53.82 81.15,55.22 82.3,55.22 v1(82.8,54.71)
PB9: length 60.1
  Top Layer w0.203: U14.2 U14.1 ; 80,52.59 80.65,53.24 80.65,53.4 81.04,53.79 v1(81.04,53.79) 81.04,54.2 84.21,57.38 84.21,59.92 91.07,66.77
  Bottom Layer w0.203: H5.1 51.82,46.58 55.5,50.26 64.03,50.26 65.65,51.88 76.64,51.88 77.95,53.19 80.43,53.19 v1(81.04,53.79)
PB10: length 42.9
  Top Layer w0.203: 63.39,31.21 63.44,31.16 63.83,31.16 70.99,38.33 70.99,39.98 73.79,42.77 74.63,42.77 74.94,43.09 74.94,43.29 76.13,44.47 ; U10.5 v1(78.36,23.21)
  Top Layer w0.381: U13.29 U13.30
  Bottom Layer w0.203: U13.30 70,31.21 70.01,31.21 72.14,31.21 78.36,24.99 v1(78.36,23.21)
PB11: length 45
  Top Layer w0.203: 76.48,44.12 74.56,42.2 73.91,42.2 71.91,40.2 71.91,37.34 63.37,28.8 U13.32 ; U10.1 80.96,22.77 79.12,24.61 77.09,24.61 73.03,28.67 U13.32 ; U13.32 U13.31
PB12: length 44.5
  Top Layer w0.203: U10.23 77.72,14.69 77.72,16.1 79.63,18.01 82.81,18.01 85.53,20.72 85.53,26.3 ; 85.53,26.3 85.58,26.25 U14.33 U14.34 ; 85.53,26.3 85.53,33.49 79.76,39.26 79.76,42.99 79.35,43.4
PB13: length 38.4
  Top Layer w0.203: 90.35,28.79 U14.31 U14.32 ; U10.3 v1(79.66,23.21) ; 90.35,28.79 87.56,31.58 87.56,33.11 81.91,38.75 81.91,41.54 79.7,43.75
  Bottom Layer w0.203: v1(79.66,23.21) 79.66,24 80.52,24.86 82.93,24.86 86.86,28.79 U14.31
PB14: length 45.7
  Top Layer w0.203: U14.30 U14.29 90.23,31.33 89.97,31.58 89.97,32.22 82.55,39.64 82.55,41.61 80.06,44.11 ; U10.11 v1(74.46,23.21)
  Bottom Layer w0.203: U14.29 88,31.33 83.06,26.39 80.9,26.39 78.99,24.48 78.99,22.7 78.61,22.32 76.2,22.32 75.82,22.7 75.82,23.97 75.56,24.23 74.8,24.23 74.46,23.88 v1(74.46,23.21)
PB15: length 18.3
  Top Layer w0.203: U14.28 U14.27 89.85,33.87 83.24,40.47 83.24,41.63 80.41,44.46
PC13: length 26.2
  Top Layer w0.203: 76.81,52.92 76.82,52.92 ; 76.81,52.92 76.2,53.53 76.2,53.9 76.66,54.36 77.12,54.36 v1(77.47,54.71) ; 76.81,52.92 77.29,52.44
  Top Layer w0.254: 63.37,66.77 60.83,66.77
  Bottom Layer w0.203: U13.2 66.3,66.77 71.75,61.31 72.64,61.31 75.06,58.9 75.06,57.88 77.47,55.47 v1(77.47,54.71)
REFP: length 13.7
  Top Layer w0.349: v1(17.82,45.1) 18.08,44.84 U1.7
  Top Layer w0.381: C8.2 v1(25.26,53.16)
  内层2-power w0.349: v1(17.82,45.1) 25.26,52.54 v1(25.26,53.16)
RESET: length 24.8
  Top Layer w0.203: H3.2 42.55,42.01 32.64,42.01 31.88,41.25 23.37,41.25 21.07,43.54 U1.9
START: length 18.3
  Top Layer w0.203: H4.2 42.29,49.12 26.92,49.12 25.9,48.09 U1.19
SWCLK: length 26.1
  Top Layer w0.203: v1(84.2,50.52) 84.2,50.43 83.19,49.42
  Bottom Layer w0.203: H1.3 80.77,72.51 80.77,68.3 85.34,63.73 85.34,51.66 v1(84.2,50.52)
SWIO: length 32.2
  Top Layer w0.203: v1(83.57,45.69) 83.42,45.69 82.53,46.58
  Bottom Layer w0.203: H1.2 78.11,68.42 84.46,62.07 84.46,56.99 83.64,56.18 83.64,47.9 84.46,47.09 84.46,46.2 83.95,45.69 v1(83.57,45.69)
$1N9515: length 10
  Top Layer w0.254: C3.2 33.4,68.54 33.4,67.66 32.83,67.09 U3.1 32.83,65.76 32.57,65.5 31.37,65.5 30.93,65.95 30.93,66.68
  Top Layer w0.508: L1.2 33.26,72.3 C3.2
$1N9516: length 1
  Top Layer w0.381: 26.54,79.6 26.53,79.59 25.59,79.59
$1N9520: length 7.3
  Top Layer w0.381: 25.59,78.59 25.59,78.21 25.08,77.7 24.13,77.7 23.75,77.31 23.75,72.62
$1N10642: length 1.9
  Top Layer w0.381: R3.2 24.54,66.87 24.73,66.68 U5.3
$1N10736: length 1.6
  Top Layer w0.381: C6.2 22.58,65.59 24.09,65.59
$1N13390: length 0.1
  Top Layer w0.203: 67.45,75.46 LED1.2
$1N15546: length 5.8
  Bottom Layer w0.381: R6.2 84.51,35.33 83.44,34.26 83.44,33.86 J1.3
$1N17400: length 2.4
  Top Layer w0.381: R7.1 80.76,28.64 J1.4
$1N19382: length 19.1
  Bottom Layer w0.381: RF4.1 10.91,72.22 BT2.1
$1N21170: length 2
  Top Layer w0.254: U10.17 73.79,14.66 C35.1
$1N21195: length 30.1
  Top Layer w0.254: v1(75.06,7.34) 72.51,9.89 U10.15
  Bottom Layer w0.203: v1(75.06,7.34) 76.84,5.56 88.14,5.56 88.65,5.05 95.81,5.05
$1N21199: length 29
  Top Layer w0.254: v1(73.28,10.13) 73.16,10.25 U10.16
  Bottom Layer w0.203: v1(73.28,10.13) 77.22,6.19 88.52,6.19 89.01,5.7 95.81,5.7
$1N21362: length 4.4
  Bottom Layer w0.203: 93.62,9.07 93.62,7.31 U11.1 94.74,7.17 USB2.1
$1N23716: length 2.5
  Top Layer w0.254: 63.37,61.69 60.83,61.69
$1N23719: length 2.5
  Top Layer w0.254: 63.37,64.23 60.83,64.23
$1N25080: length 7.4
  Top Layer w0.381: 12.96,34.65 18.04,29.56 U16.2
$1N25084: length 7.4
  Top Layer w0.381: U16.3 20.58,29.56 15.5,34.65
$1N25089: length 7.4
  Top Layer w0.381: U16.4 23.12,29.56 18.04,34.65
$1N25094: length 7.4
  Top Layer w0.381: U16.5 25.66,29.56 20.58,34.65
$1N25099: length 7.4
  Top Layer w0.381: U16.6 28.2,29.56 23.12,34.65
$1N25104: length 7.4
  Top Layer w0.381: 25.66,34.65 30.74,29.56 U16.7
$1N25109: length 7.4
  Top Layer w0.381: 28.2,34.65 33.28,29.56 U16.8
$1N25114: length 7.4
  Top Layer w0.381: 30.74,34.65 35.82,29.56 U16.9
$1N25119: length 7.4
  Top Layer w0.381: 33.28,34.65 38.36,29.56 U16.10
$1N25132: length 7.4
  Top Layer w0.381: 35.82,34.65 40.9,29.56 U16.11
$1N25136: length 7.4
  Top Layer w0.381: U16.12 43.44,29.56 38.36,34.65
$1N25141: length 7.4
  Top Layer w0.381: U16.13 45.98,29.56 40.9,34.65
$1N25146: length 7.4
  Top Layer w0.381: U16.14 48.52,29.56 43.44,34.65
$1N25151: length 7.4
  Top Layer w0.381: U16.15 51.06,29.56 45.98,34.65
$1N25156: length 7.4
  Top Layer w0.381: U16.16 53.6,29.56 48.52,34.65
$1N25161: length 7.4
  Top Layer w0.381: U16.1 15.5,29.56 10.42,34.65

## Copper pours and planes (outline as drawn; the poured copper is in the pictures)
+3.3V2 on Top Layer: 61.21,76.43 61.71,76.43 62.14,76 63.42,76 63.42,74.58 62.1,74.58 62.1,74.59 62.1,75.47 61.78,75.79 61.45,75.79 61.21,76.02
+3.3V2 on 内层2-power: 59.44,75.03 75.56,75.03 82.19,67.1 82.19,59.54 70.99,48.34 78.33,40.99 78.33,36.42 77.46,35.56 77.46,32.9 76.15,31.59 60.83,31.59 47.24,45.18 47.24,62.84
+5V on Top Layer: 26.57,65.35 26.19,64.97 25.84,64.97 25.84,66.84 25.68,67 25.68,67.89 25.8,68.02 26.57,68.02
+5V on Top Layer: 32.77,64.61 35.68,64.61 35.68,63.31 33.31,63.31 32.89,63.73 32.89,64.49
+5V on 内层2-power: 13.52,50.33 14.85,51.66 21.46,51.66 32.77,62.96 36.19,62.96 37.59,61.57 37.59,59.24 21.76,43.41 14.73,43.41 13.59,44.55 13.59,46.2 13.52,46.27
+5V2 on Top Layer: 84.96,88.11 84.96,85.5 85.78,86.31 86.61,86.31 86.61,87.16 85.92,87.16
+5V2 on 内层2-power: 49.91,93.95 94.36,93.95 94.36,5.94 49.91,5.94
+12V on Top Layer: 21.99,80.04 21.99,82.89 23.88,82.89 23.88,81.25 22.99,80.36 22.99,80.04
+12V on 内层2-power: 19.94,83.03 35.43,98.52 61.09,98.52 66.93,92.68 66.93,86.75 62.39,82.21 53.28,82.21 41.66,70.58 27.43,70.58 19.94,78.08
AGND on Top Layer: 21.84,77.06 23.24,77.06 23.24,73.84 22.41,73.84 22.41,74.97 21.97,75.41 21.97,76.93
AGND on Top Layer: 27.58,57.99 27.58,57.1 26.88,56.4 26.88,55.27 26.82,55.21 26.82,54.56 26.44,54.18 25.98,54.18 25.93,54.23 25.93,54.43 26.09,54.58 26.09,56.94 25.93,57.1 26.19,57.35 26.19,57.61 26.57,57.99
AGND on Top Layer: 65.01,86.47 65.59,85.89 66.29,85.89 66.47,85.7 65.83,85.05 64.76,85.05 64.76,86.22
AGND on Top Layer: 65.56,93.28 69.45,93.28 69.45,80.25 65.56,80.25
AGND on Top Layer: 27.07,64.59 27.46,64.21 27.46,60.85 27.05,60.44 25.38,60.44 25.3,60.53 25.3,61.67 23.07,63.89 22.1,63.89 22.1,64.44 22.25,64.59
AGND on Top Layer: 26.31,61.04 27.58,59.77 27.58,57.69 26.23,57.69 26.06,57.86 26.06,59.77 25.3,60.53 25.81,61.04
AGND on Top Layer: 21.84,77.06 21.84,78.33 22.23,78.71 23.11,78.71 23.5,79.09 23.88,79.09 24.77,78.2 23.47,78.2 23.2,77.94 23.2,77.04 21.87,77.04
AGND on Top Layer: 75.31,54.2 73.15,52.04 69.34,52.04 67.56,53.82 67.56,57.88 69.22,59.53 74.04,59.53 75.31,58.26
AGND on Top Layer: 81.74,48.42 78.14,44.83 74.55,48.42 78.14,52.01
AGND on Top Layer: 30.6,67.99 30.79,67.99 31.62,67.15 32.18,67.15 32.18,69.04 31.88,69.33 30.6,68.06
AGND on Top Layer: 24.38,82.78 24.38,81.51 25.19,80.7 25.19,80.09 26.02,80.09 26.04,80.11 26.04,82.71 25.94,82.8 24.41,82.8
AGND on Top Layer: 75.28,65.98 82.49,58.77 78.84,55.12 71.63,62.33
AGND on Bottom Layer: 75.27,54.25 73.24,52.22 69.17,52.22 67.52,53.87 67.52,57.93 69.17,59.59 74,59.59 75.27,58.32
AGND on Bottom Layer: 75.31,65.85 82.52,58.64 78.87,54.99 71.66,62.21
AGND on 内层1-GND: 0,100 100,100 100,0 0,0
REFP on Top Layer: 24.92,60.65 24.92,60.4 25.55,59.77 25.55,55.32 25.68,55.19 25.68,53.92 24.92,53.92 24.92,55.83 24.79,55.96 24.79,59.26 24.22,59.83 24.22,60.72 24.28,60.78 24.79,60.78
REFP on Top Layer: 20.22,62.05 24.66,62.05 24.92,61.8 24.92,60.58 24.73,60.4 23.39,60.4 23.01,60.78 20.22,60.78
$1N9515 on Top Layer: 25.55,69.82 39.12,69.82 39.62,70.33 39.62,76.73 39.12,77.24 25.55,77.24 25.04,76.73 25.04,70.33
$1N9515 on Top Layer: 24.89,75.54 26.42,75.54 26.42,74.9 25.91,74.39 25.08,74.39 25.08,75.35
$1N9516 on Top Layer: 25.93,79.72 29.84,83.41 29.84,84.43 34.67,84.43 34.8,84.3 34.8,80.49 29.97,80.49 28.84,79.36 26.27,79.36 25.92,79.72
$1N9520 on Top Layer: 22.4,72.95 25.98,72.95 25.98,72.18 22.4,72.18
$1N22122 on Top Layer: 68.87,86.82 69.33,86.82 70.99,88.49 74.3,88.49 74.3,84.05 73.79,83.54 71.63,83.54 71.25,83.92 71.25,84.68 69.35,86.57 69.12,86.57
$1N25600 on Top Layer: 24.5,59.72 24.5,57.06 24.41,56.97 23.35,56.97 22.33,57.99 21.61,57.99 21.36,58.24 21.36,59.13 21.23,59.26 22.6,59.26 22.96,59.62 24.4,59.62

Small or netless copper shapes (teardrops, artwork), in the pictures only: 2 on Top Layer

## Text on the board
Bottom Silkscreen Layer: BOOT0 | BOOT1 | LOW | HIGH | PC13 | NRST | PA0 | PA1 | PA2 | PA3 | PA4-SPI1NSS | PA5-SPI1SCK | PA6-SPI1MISO | PA7-SPI1MISO | PB0 | PB1 | PB10-USART3TX | PB11-USART3RX | NC | +5V | +3.3V | GND | PB9-DRDY | PB8-START | PB7-I2C1SDA | PB6-I2C1SCL | PA15-RESET | U3RTS | U3CTS | U3CK | PB5 | PB3 | PB4 | PA9 | PA8 | PA11 | PB15 | PB13 | PB12 | PB14 | PA12 | PA10 | VCC | SDA | SCL | SIGNAL_IN | BAT_OUT | 光电功能材料与器件研究所
Top Silkscreen Layer: DRDY | START | RESET | 3.3V | SWCLK | GND | SWIO | BAT_OUT | SIGNAL_IN | 光电功能材料与器件研究所
